# EAGLE design Iris v1 (EAGLE 7.7.0)
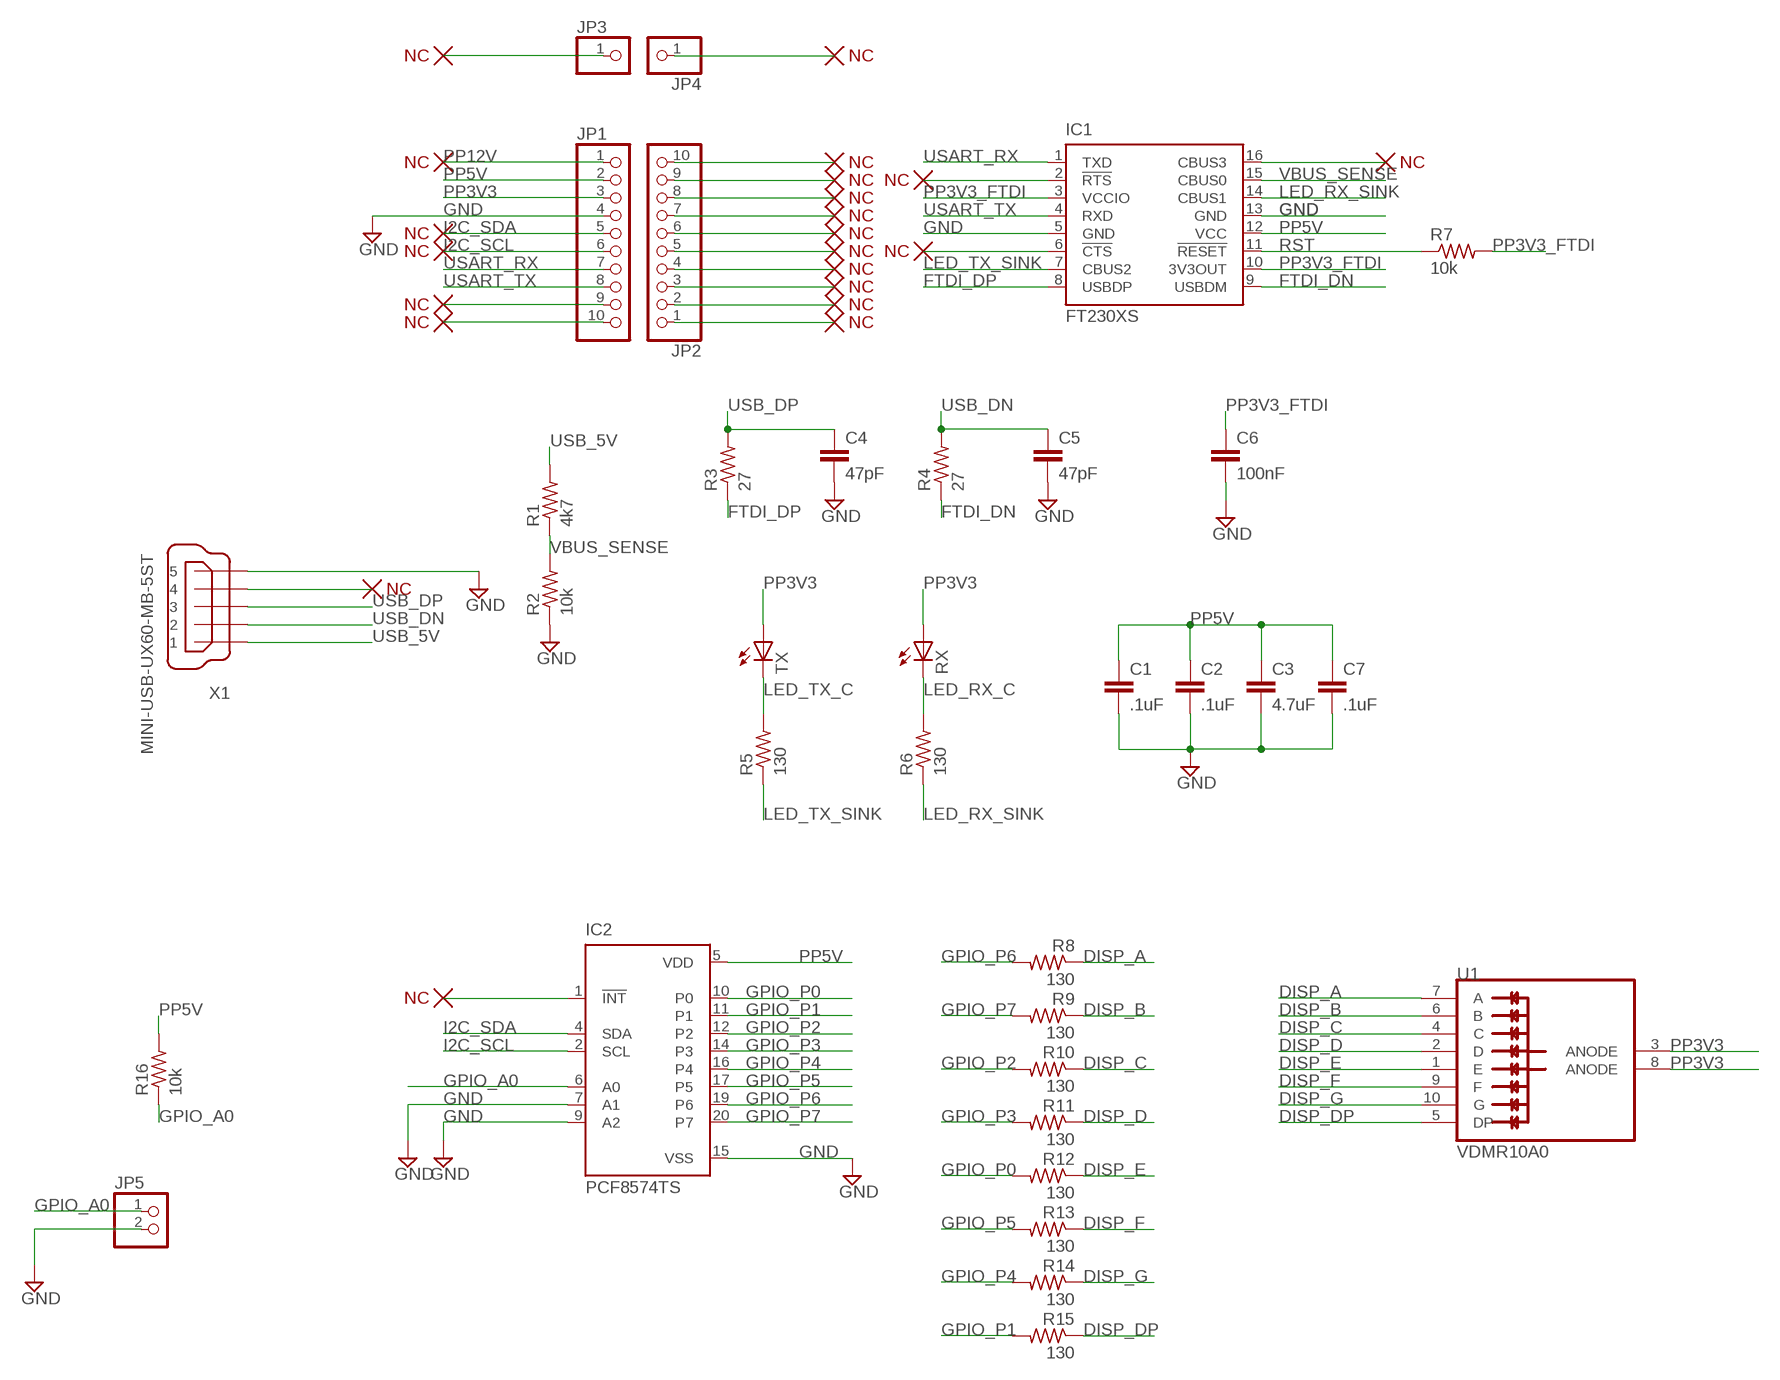
[diagram p0: schematic, sheet 1]

## Parts
C1  .1uF  C-EUC0402  [C0402]
C2  .1uF  C-EUC0402  [C0402]
C3  4.7uF  C-EUC0603  [C0603]
C4  47pF  C-EUC0402  [C0402]
C5  47pF  C-EUC0402  [C0402]
C6  100nF  C-EUC0402  [C0402]
C7  .1uF  C-EUC0402  [C0402]
IC1  FT230XS  [SSOP16]
IC2  PCF8574TS  [SSOP20]
JP1  PINHD-1X10  [1X10]
JP2  PINHD-1X10  [1X10]
JP3  PINHD-1X1  [1X01]
JP4  PINHD-1X1  [1X01]
JP5  PINHD-1X2  [1X02]
R1  4k7  R-US_R0402  [R0402]
R2  10k  R-US_R0402  [R0402]
R3  27  R-US_R0402  [R0402]
R4  27  R-US_R0402  [R0402]
R5  130  R-US_R0402  [R0402]
R6  130  R-US_R0402  [R0402]
R7  10k  R-US_R0603  [R0603]
R8  130  R-US_R0402  [R0402]
R9  130  R-US_R0402  [R0402]
R10  130  R-US_R0402  [R0402]
R11  130  R-US_R0402  [R0402]
R12  130  R-US_R0402  [R0402]
R13  130  R-US_R0402  [R0402]
R14  130  R-US_R0402  [R0402]
R15  130  R-US_R0402  [R0402]
R16  10k  R-US_R0402  [R0402]
RX  LEDCHIP-LED0603  [CHIP-LED0603]
TX  LEDCHIP-LED0603  [CHIP-LED0603]
U1  VDMR10.0  [VDMR10A0]
X1  MINI-USB-UX60-MB-5ST  [UX60-MB-5ST]

## Nets
DISP_A: R8.1 U1.7(A)
DISP_B: R9.1 U1.6(B)
DISP_C: R10.1 U1.4(C)
DISP_D: R11.1 U1.2(D)
DISP_DP: R15.1 U1.5(DP)
DISP_E: R12.1 U1.1(E)
DISP_F: R13.1 U1.9(F)
DISP_G: R14.1 U1.10(G)
FTDI_DN: IC1.9(USBDM) R4.1
FTDI_DP: IC1.8(USBDP) R3.1
GND: C1.2 C2.2 C3.2 C4.2 C5.2 C6.2 C7.2 IC1.5(GND) IC1.13(GND) IC2.7(A1) IC2.9(A2) IC2.15(VSS) JP1.4 JP5.2 R2.1 X1.5
GPIO_A0: IC2.6(A0) JP5.1 R16.1
GPIO_P0: IC2.10(P0) R12.2
GPIO_P1: IC2.11(P1) R15.2
GPIO_P2: IC2.12(P2) R10.2
GPIO_P3: IC2.14(P3) R11.2
GPIO_P4: IC2.16(P4) R14.2
GPIO_P5: IC2.17(P5) R13.2
GPIO_P6: IC2.19(P6) R8.2
GPIO_P7: IC2.20(P7) R9.2
I2C_SCL: IC2.2(SCL) JP1.6
I2C_SDA: IC2.4(SDA) JP1.5
LED_RX_C: R6.2 RX.C
LED_RX_SINK: IC1.14(CBUS1) R6.1
LED_TX_C: R5.2 TX.C
LED_TX_SINK: IC1.7(CBUS2) R5.1
N$1: IC1.2(!RTS)
N$2: IC1.6(!CTS)
N$3: IC1.16(CBUS3)
N$4: JP3.1
N$5: JP4.1
N$7: X1.4
N$12: JP2.10
N$13: JP2.9
N$17: JP2.8
N$18: JP2.7
N$19: JP2.6
N$20: JP2.5
N$21: JP2.4
N$22: JP2.3
N$23: JP1.9
N$24: JP1.10
N$25: JP2.2
N$26: JP2.1
N$28: IC2.1(!INT)
PP3V3: JP1.3 RX.A TX.A U1.3(ANODE) U1.8(ANODE)
PP3V3_FTDI: C6.1 IC1.3(VCCIO) IC1.10(3V3OUT) R7.2
PP5V: C1.1 C2.1 C3.1 C7.1 IC1.12(VCC) IC2.5(VDD) JP1.2 R16.2
PP12V: JP1.1
RST: IC1.11(!RESET) R7.1
USART_RX: IC1.1(TXD) JP1.7
USART_TX: IC1.4(RXD) JP1.8
USB_5V: R1.2 X1.1
USB_DN: C5.1 R4.2 X1.2
USB_DP: C4.1 R3.2 X1.3
VBUS_SENSE: IC1.15(CBUS0) R1.1 R2.2

## Library data of the parts
C1-C7 = resistor:C-EU: CAPACITOR, European symbol
IC1 = ftdichip:FT230X: USB to BASIC UART IC Auto generated by make-symbol-device-package-bsdl.ulp Rev. 43 Source: Data sheet <http://www.ftdichip.com/Support/Documents/DataSheets/ICs/DS_FT230X.pdf>; DIGI: 768-1135-1-ND
IC2 = micro-philips:PCF8574: I2C-Bus Remote 8-bit I/O expander http://www.semiconductors.philips.com/acrobat_download/datasheets/PCF8574_4.pdf; DIGI: 568-8246-1-ND; MPN: PCF8574TS/3,118; OC_FARNELL: 1506644; OC_NEWARK: 70R6873
JP1 JP2 = pinhead:PINHD-1X10: PIN HEADER
JP3 JP4 = pinhead:PINHD-1X1: PIN HEADER
JP5 = pinhead:PINHD-1X2: PIN HEADER
R1-R6 R8-R16 = resistor:R-US_: RESISTOR, American symbol
R7 = rcl:R-US_: RESISTOR, American symbol
RX TX = led:LED: LED OSRAM: - CHIPLED LG R971, LG N971, LY N971, LG Q971, LY Q971, LO R971, LY R971 LH N974, LH R974 LS Q976, LO Q976, LY Q976 LO Q996 - Hyper CHIPLED LW Q18S LB Q993, LB Q99A, LB R99A - SideLED LS A670, LO A670, LY A670, LG A670, LP A670 LB A673, LV A673, LT A673, LW A673 LH A674 LY A675 LS A676, LA A676, LO A676, LY A676, LW A676 LS A679, LY A679, LG A679 - Hyper Micro SIDELED® LS Y876, LA Y876, LO Y876, LY Y876 LT Y87S - SmartLED LW L88C, LW L88S LB L89C, LB L89S, LG L890 LS L89K, LO L89K, LY L89K LS L896, LA L896, LO L896, LY L896 - TOPLED LS T670, LO T670, LY T670, LG T670, LP T670 LSG T670, LSP T670, LSY T670, LOP T670, LYG T670 LG T671, LOG T671, LSG T671 LB T673, LV T673, LT T673, LW T673 LH T674 LS T676, LA T676, LO T676, LY T676, LB T676, LH T676, LSB T676, LW T676 LB T67C, LV T67C, LT T67C, LS T67K, LO T67K, LY T67K, LW E67C LS E67B, LA E67B, LO E67B, LY E67B, LB E67C, LV E67C, LT E67C LW T67C LS T679, LY T679, LG T679 LS T770, LO T770, LY T770, LG T770, LP T770 LB T773, LV T773, LT T773, LW T773 LH T774 LS E675, LA E675, LY E675, LS T675 LS T776, LA T776, LO T776, LY T776, LB T776 LHGB T686 LT T68C, LB T68C - Hyper Mini TOPLED® LB M676 - Mini TOPLED Santana® LG M470 LS M47K, LO M47K, LY M47K Source: http://www.osram.convergy.de LUXEON: - LUMILED® LXK2-PW12-R00, LXK2-PW12-S00, LXK2-PW14-U00, LXK2-PW14-V00 LXK2-PM12-R00, LXK2-PM12-S00, LXK2-PM14-U00 LXK2-PE12-Q00, LXK2-PE12-R00, LXK2-PE12-S00, LXK2-PE14-T00, LXK2-PE14-U00 LXK2-PB12-K00, LXK2-PB12-L00, LXK2-PB12-M00, LXK2-PB14-N00, LXK2-PB14-P00, LXK2-PB14-Q00 LXK2-PR12-L00, LXK2-PR12-M00, LXK2-PR14-Q00, LXK2-PR14-R00 LXK2-PD12-Q00, LXK2-PD12-R00, LXK2-PD12-S00 LXK2-PH12-R00, LXK2-PH12-S00 LXK2-PL12-P00, LXK2-PL12-Q00, LXK2-PL12-R00 Source: www.luxeon.com KINGBRIGHT: KA-3528ASYC Source: www.kingbright.com; DIGI: 160-1434-1-ND
U1 = DLussierLibrary:VDMR10.0: VDMR10A0; DIGI: VDMR10A0CT-ND
X1 = con-hirose:MINI-USB-: MINI USB Connector Source: http://www.hirose.co.jp/cataloge_hp/e24000019.pdf; DIGI: H2959CT-ND; OC_FARNELL: unknown; OC_NEWARK: unknown

## Board
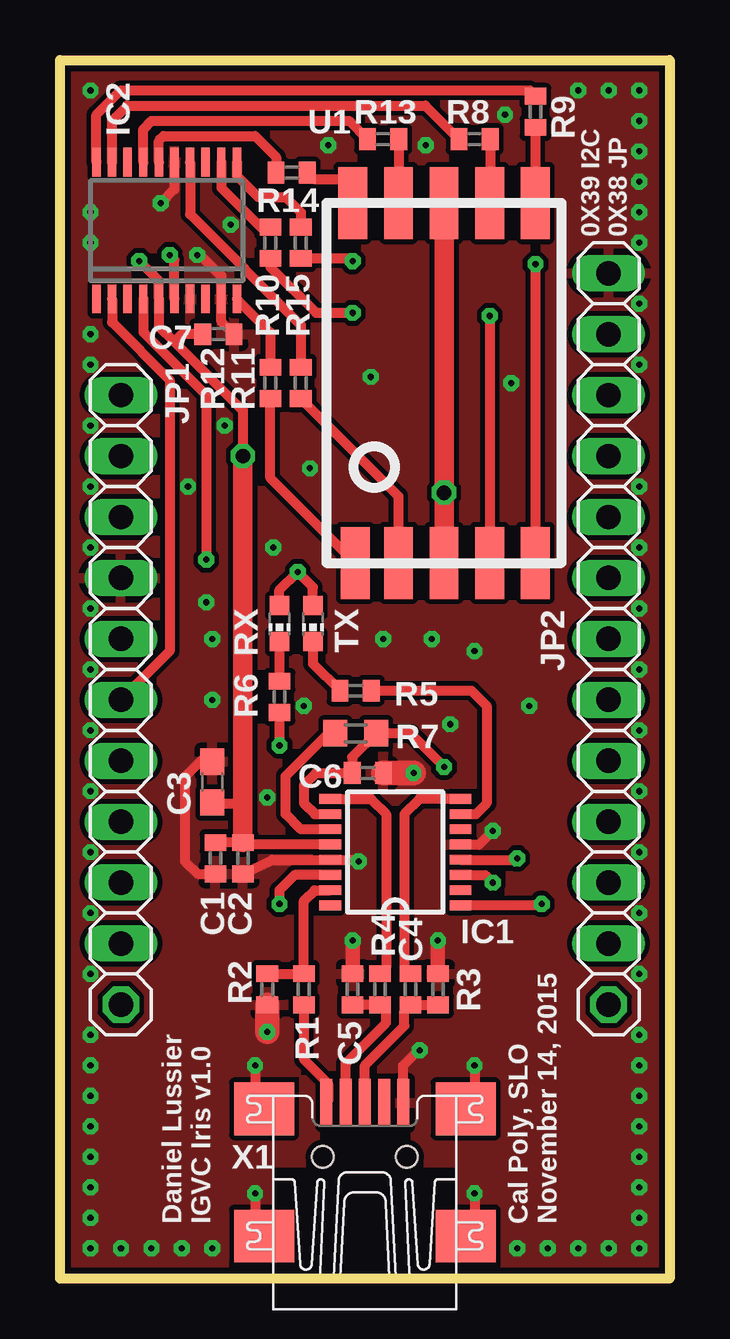
[diagram p1: board, top side]
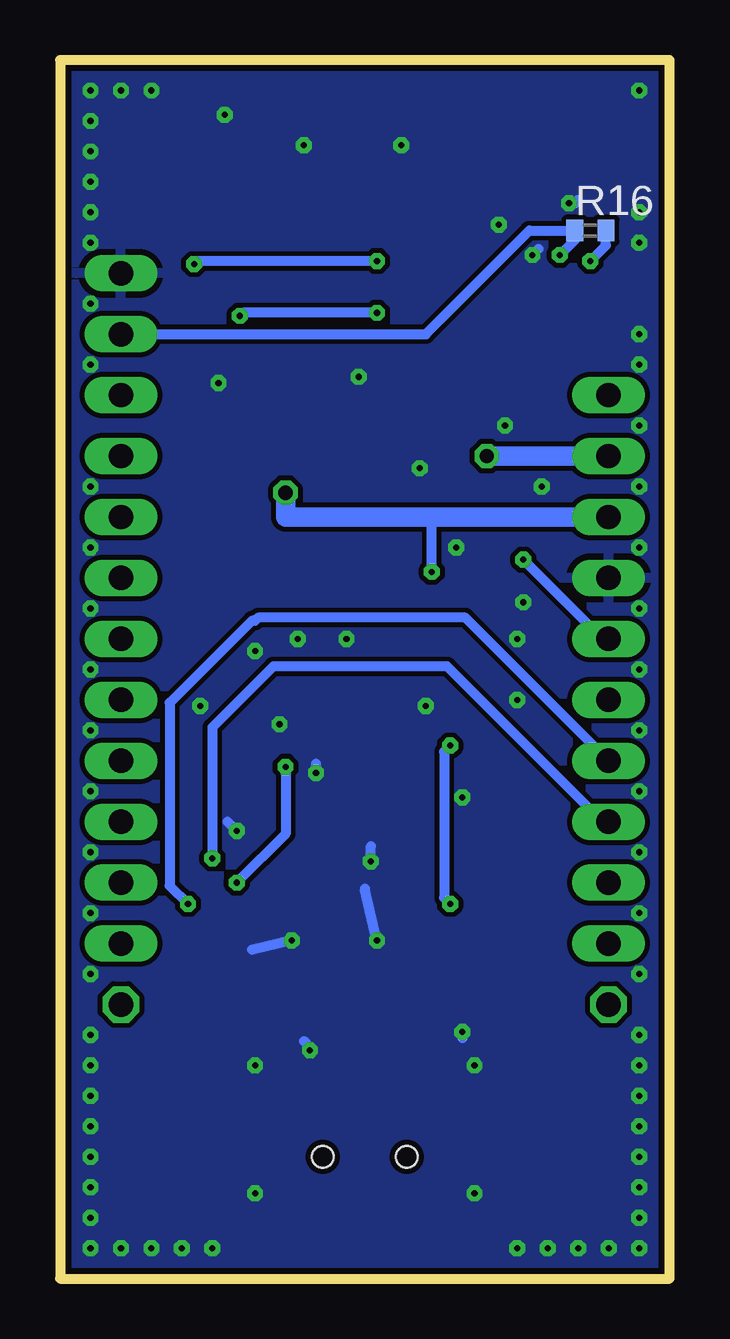
[diagram p2: board, bottom side, seen from below]

Size 25.4 x 50.8 mm. Coordinates in mm from the lower left corner, seen from the top.
Outline: 0,0 0,50.8 25.4,50.8 25.4,0 0,0
Copper layers (1*16): Top 0.035mm / dielectric 1.5mm / Bottom 0.035mm
Design rules "default *": minimum track width 10mil, minimum drill 10mil, track to track 8mil, track to pad 8mil, pad to pad 8mil, via to via 8mil, smd to smd 8mil, copper to edge 10mil, drill to drill 8mil, minimum pad ring 10mil, minimum via ring 8mil, stop-mask expansion 4mil, vias tented up to drill 0mil, thermal gap 10mil

### Footprints (pad centres in the part's own frame; a part is rotated, then mirrored left to right if it is on the bottom)
C0402 = smd 0.7 x 0.9: 1 -0.65,0; 2 0.65,0
C0603 = smd 1.1 x 1: 1 -0.85,0; 2 0.85,0
SSOP16 = smd 0.914 x 0.406: 1 -2.718,2.223; 2 -2.718,1.587; 3 -2.718,0.953; 4 -2.718,0.318; 5 -2.718,-0.318; 6 -2.718,-0.953; 7 -2.718,-1.587; 8 -2.718,-2.223; 9 2.718,-2.223; 10 2.718,-1.587; 11 2.718,-0.953; 12 2.718,-0.318; 13 2.718,0.318; 14 2.718,0.953; 15 2.718,1.587; 16 2.718,2.223
SSOP20 = smd 0.35 x 1.2: 1 -2.925,-2.85; 2 -2.275,-2.85; 3 -1.625,-2.85; 4 -0.975,-2.85; 5 -0.325,-2.85; 6 0.325,-2.85; 7 0.975,-2.85; 8 1.625,-2.85; 9 2.275,-2.85; 10 2.925,-2.85; 11 2.925,2.85; 12 2.275,2.85; 13 1.625,2.85; 14 0.975,2.85; 15 0.325,2.85; 16 -0.325,2.85; 17 -0.975,2.85; 18 -1.625,2.85; 19 -2.275,2.85; 20 -2.925,2.85
1X10 = drill 1.016 long: 1 -11.43,0; 2 -8.89,0; 3 -6.35,0; 4 -3.81,0; 5 -1.27,0; 6 1.27,0; 7 3.81,0; 8 6.35,0; 9 8.89,0; 10 11.43,0
1X01 = drill 1.016 octagon: 1 0,0
1X02 = drill 1.016 long: 1 -1.27,0; 2 1.27,0
R0402 = smd 0.7 x 0.9: 1 -0.65,0; 2 0.65,0
R0603 = smd 1 x 1.1: 1 -0.85,0; 2 0.85,0
CHIP-LED0603 = smd 0.8 x 0.8: A 0,-0.75; C 0,0.75
VDMR10A0 = smd 1.2 x 3: 1 -3.7,-7.5; 2 -1.9,-7.5; 3 0,-7.5; 4 1.9,-7.5; 5 3.8,-7.5; 6 3.8,7.5; 7 1.9,7.5; 8 0,7.5; 9 -1.9,7.5; 10 -3.8,7.5
UX60-MB-5ST = smd 2 x 0.5: 1 2.25,1.6; 2 2.25,0.8; 3 2.25,0; 4 2.25,-0.8; 5 2.25,-1.6 | smd 2.2 x 2.5: M1 -3.3,-4.2; M2 -3.3,4.2; M3 2,4.2; M4 2,-4.2 | hole 0.9: 0,-1.75; 0,1.75

### Placement (x,y rotation side)
C1  6.48,17.53 270 top
C2  7.62,17.53 270 top
C3  6.35,20.7 90 top
C4  15.75,12.06 90 top
C5  12.19,12.06 90 top
C6  12.83,21.08 0 top
C7  6.6,39.37 0 top
IC1  13.97,17.78 180 top
IC2  4.45,43.69 0 top
JP1  2.54,25.4 270 top
JP2  22.86,25.4 90 top
JP3  2.54,11.43 0 top
JP4  22.86,11.43 0 top
JP5  22.86,40.64 90 top
R1  10.16,12.06 270 top
R2  8.64,12.06 90 top
R3  14.61,12.06 270 top
R4  13.34,12.06 270 top
R5  12.32,24.51 180 top
R6  9.14,24.26 90 top
R7  12.32,22.73 0 top
R8  17.27,47.5 180 top
R9  19.81,48.64 90 top
R10  8.76,43.18 90 top
R11  10.03,37.34 90 top
R12  8.76,37.34 90 top
R13  13.46,47.5 180 top
R14  9.65,46.1 180 top
R15  10.03,43.18 90 top
R16  3.3,43.69 0 bottom
RX  9.14,27.3 180 top
TX  10.54,27.3 180 top
U1  16,37.34 0 top
X1  12.7,5.08 90 top

### Tracks (layer width: path | path; a pad name or v marks a point on that pad's centre or on a via)
DISP_A
  Top 0.406: R8.1 17.92,44.86 U1.7
DISP_B
  Top 0.406: R9.1 19.81,44.85 U1.6
DISP_C  (via drill 0.25)
  Top 0.406: R10.1 8.76,42.16 10.67,40.26 v12.19,40.26 | v17.91,40.13 17.91,30.86 17.78,30.73 17.78,29.96 U1.4
  Bottom 0.406: v12.19,40.26 17.78,40.26 v17.91,40.13
DISP_D
  Top 0.406: U1.2 14.1,30.86 14.1,32.11 14.1,32.62 R11.1
DISP_DP  (via drill 0.25)
  Top 0.406: R15.1 12.08,42.53 v12.19,42.42 | v19.81,42.29 19.81,30.48 19.94,30.35 19.94,29.98 U1.5
  Bottom 0.406: v12.19,42.42 19.68,42.42 v19.81,42.29
DISP_E
  Top 0.406: U1.1 8.76,33.38 R12.1
DISP_F
  Top 0.406: 14.22,45.34 14.1,45.47 14.1,45.85 14.1,45.84 U1.9 14.11,44.85 R13.1
DISP_G
  Top 0.406: U1.10 12.32,44.95 12.32,45.72 12.19,45.72 12.08,45.83 10.57,45.83 R14.1
FTDI_DN
  Top 0.406: IC1.9 12.95,20 13.59,19.37 13.59,12.97 R4.1
FTDI_DP
  Top 0.406: IC1.8 14.99,20 14.35,19.37 14.35,12.97 R3.1
GND  (via drill 0.25)
  Top 0.406: v12.45,17.4 12.26,17.46 IC1.13 8.84,17.46 C2.2 | IC1.5 17.46,18.1 v18.03,18.67 | C3.2 5.84,21.55 | 5.84,21.55 5.21,20.92 5.21,17.4 5.73,16.88 C1.2 | 5.84,21.55 5.88,21.59 6.35,21.59 6.35,21.46 | v15.75,14.1 15.75,13.97 | X1.5 14.3,8.89 14.94,9.53 v14.99,9.53 | IC2.15 4.77,45.41 v4.19,44.83 | v5.71,42.67 5.84,42.67 6.72,41.79 IC2.9 6.72,39.9 C7.2 | v8.13,8.89 8.13,7.62 | v8.13,3.56 8.13,2.29 | v17.27,3.56 17.27,2.29 | v17.27,8.89 17.27,7.62
  Top 0.61: 15.75,13.97 C4.2 | v12.19,14.1 C5.2
  Top 1.016: R2.1 v8.64,10.29 | v14.73,21.08 C6.2
  Bottom 0.406: v15.75,14.1 17.4,13.72 | v12.19,14.1 12.7,16.26 | v8.64,10.29 8.64,10.03 | v12.45,17.4 12.45,18.03 | v18.03,18.67 18.41,19.05 | v14.73,21.08 14.73,21.46 | v14.99,9.53 14.99,9.65 15.24,9.91 | v5.71,42.67 5.46,42.93 | v4.19,44.83 3.94,44.83 3.81,44.96
  other vias: 24.13,1.27 24.13,2.54 24.13,3.81 24.13,5.08 24.13,6.35 24.13,7.62 24.13,8.89 24.13,10.16 22.86,1.27 21.59,1.27 20.32,1.27 19.05,1.27 6.35,1.27 5.08,1.27 3.81,1.27 2.54,1.27 1.27,1.27 1.27,2.54 1.27,3.81 1.27,5.08 1.27,6.35 1.27,7.62 1.27,8.89 1.27,10.16 1.27,39.37 1.27,49.53 1.27,43.18 1.27,44.45 21.59,49.53 22.86,49.53 24.13,49.53 24.13,48.26 24.13,46.99 24.13,45.72 24.13,44.45 24.13,43.18 24.13,40.64 11.18,47.24 12.95,37.59 18.8,37.34 10.41,33.78 16.26,23.11 8.89,30.48 6.1,28.19 6.35,26.67 6.35,24.13 13.46,26.67 15.49,26.67 19.56,23.88 17.27,26.16 10.16,23.88 6.86,35.56 18.54,48.51 15.24,47.24 7.11,43.94 8.64,20.07 5.33,33.02 1.27,35.56 1.27,33.02 1.27,30.48 1.27,27.94 1.27,25.4 1.27,22.86 1.27,20.32 1.27,17.78 1.27,15.24 1.27,12.7 24.13,12.7 24.13,15.24 24.13,17.78 24.13,20.32 24.13,22.86 24.13,25.4 24.13,27.94 24.13,30.48 24.13,33.02 24.13,38.1 1.27,38.1
  pour Bottom: 0,50.8 25.4,50.8 25.4,0 0,0
  pour Top: 0,50.8 0,0 25.4,0 25.4,50.8
GPIO_A0  (via drill 0.25)
  Top 0.406: IC2.6 4.77,42.47 v4.57,42.67
  Bottom 0.406: v4.57,42.67 3.95,43.29 R16.1 5.84,43.69 10.16,39.37 JP5.1
GPIO_P0
  Top 0.406: IC2.10 8.76,39.45 R12.2
GPIO_P1
  Top 0.406: IC2.11 7.37,45.97 8.26,45.09 9.4,45.09 10.03,44.45 R15.2
GPIO_P2
  Top 0.406: R10.2 8.37,43.83 6.73,45.47 6.73,46.53 IC2.12
GPIO_P3
  Top 0.406: IC2.14 5.42,44.36 10.03,39.75 R11.2
GPIO_P4
  Top 0.406: IC2.16 4.12,47.43 4.32,47.62 8.13,47.62 9,46.75 R14.2
GPIO_P5
  Top 0.406: IC2.17 3.47,47.92 3.81,48.26 12.05,48.26 R13.2
GPIO_P6
  Top 0.406: R8.2 15.22,48.9 2.79,48.9 2.17,48.27 IC2.19
GPIO_P7
  Top 0.406: IC2.20 1.52,48.51 2.54,49.53 19.57,49.53 R9.2
I2C_SCL
  Top 0.406: IC2.2 2.17,39.87 4.57,37.47 4.57,26.16 JP1.6
I2C_SDA  (via drill 0.25)
  Top 0.406: IC2.4 3.47,39.46 6.1,36.83 v6.1,29.97
  Bottom 0.406: v6.1,29.97 2.79,26.67 JP1.5
LED_RX_C
  Top 0.406: RX.C R6.2
LED_RX_SINK  (via drill 0.25)
  Top 0.406: R6.1 v9.14,22.23 | IC1.14 9.78,16.83 9.14,16.19 v9.14,15.62
  Bottom 0.406: v9.14,22.23 9.4,21.97 9.4,15.88 v9.14,15.62
LED_TX_C
  Top 0.406: TX.C 10.54,25.64 R5.2
LED_TX_SINK
  Top 0.406: IC1.7 17.34,19.37 17.78,19.81 17.78,23.88 17.14,24.51 R5.1
PP3V3  (via drill 0.25, 0.6)
  Top 0.406: RX.A 9.14,28.7 v9.91,29.46 10.54,28.83 TX.A
  Top 0.813: U1.3 v16,32.77 U1.8
  Bottom 0.406: v9.91,29.46 9.91,31.62 10.03,31.75
  Bottom 0.813: JP1.3 10.03,31.75 16,31.75 v16,32.77
PP3V3_FTDI  (via drill 0.25)
  Top 0.406: v16,21.34 14.61,22.73 R7.2 12.18,21.74 C6.1 10.67,21.08 10.16,20.57 10.16,19.81 10.6,19.37 IC1.10 | IC1.3 17.72,16.83 v18.03,16.51
  Bottom 0.406: v16,21.34 16,18.54 v18.03,16.51
PP5V  (via drill 0.25, 0.6)
  Top 0.406: C1.1 C2.1 7.62,18.03 7.68,18.1 IC1.12 | C3.1 6.48,19.72 6.57,19.81 7.62,19.81 | 4.76,39.05 4.12,39.7 IC2.5 4.12,41.6 v3.3,42.42 | 4.76,39.05 7.62,36.2 v7.62,34.29 | C7.1 5.08,39.37 4.76,39.05
  Top 0.813: v7.62,34.29 7.62,19.81 C2.1
  Bottom 0.406: v3.3,42.42 2.65,43.07 R16.2
  Bottom 0.813: JP1.2 v7.62,34.29
RST
  Top 0.406: IC1.11 10.03,18.73 9.4,19.37 9.4,20.95 11.18,22.73 R7.1
USART_RX  (via drill 0.25)
  Top 0.406: IC1.1 20,15.56 v20.07,15.62
  Bottom 0.406: 2.67,21.59 JP1.7 8.51,27.56 17.14,27.56 17.27,27.43 17.4,27.43 20.83,24 20.83,16.38 v20.07,15.62
USART_TX  (via drill 0.25)
  Top 0.406: IC1.4 18.99,17.46 v19.05,17.53
  Bottom 0.406: v19.05,17.53 19.05,22.99 16.51,25.53 9.27,25.53 2.79,19.05 JP1.8
USB_5V
  Top 0.406: R1.2 10.16,9.14 11.18,8.13 11.18,7.41 X1.1
USB_DN
  Top 0.406: C5.1 R4.2 13.59,11.16 13.59,10.67 11.9,8.98 X1.2
USB_DP
  Top 0.406: C4.1 R3.2 14.35,11.16 14.35,10.54 12.7,8.89 X1.3
VBUS_SENSE
  Top 0.406: R2.2 R1.1 10.16,15.75 10.6,16.19 IC1.15

### Text on the board
tPlace: 0X39 I2C / 0X38 JP | Daniel Lussier / IGVC Iris v1.0 | Cal Poly, SLO / November 14, 2015